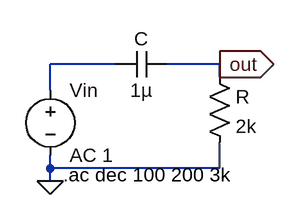
[diagram p0: schematic 4.High Pass Filter.asc]
4.High Pass Filter.asc, the LTspice schematic file:
Version 4
SHEET 1 880 680
WIRE 160 64 80 64
WIRE 288 64 224 64
WIRE 288 80 288 64
WIRE 80 96 80 64
WIRE 80 192 80 176
WIRE 288 192 288 160
WIRE 288 192 80 192
WIRE 80 208 80 192
FLAG 80 208 0
FLAG 288 64 out
IOPIN 288 64 Out
SYMBOL voltage 80 80 R0
SYMATTR InstName Vin
SYMATTR Value AC 1
SYMBOL cap 224 48 R90
WINDOW 0 0 32 VBottom 2
WINDOW 3 32 32 VTop 2
SYMATTR InstName C
SYMATTR Value 1µ
SYMBOL res 272 64 R0
SYMATTR InstName R
SYMATTR Value 2k
TEXT 96 200 Left 2 !.ac dec 100 200 3k

The netlist it stands for:
* 4.High Pass Filter.asc
Vin N001 0 AC 1
C out N001 1µ
R out 0 2k
.ac dec 100 200 3k
.backanno
.end